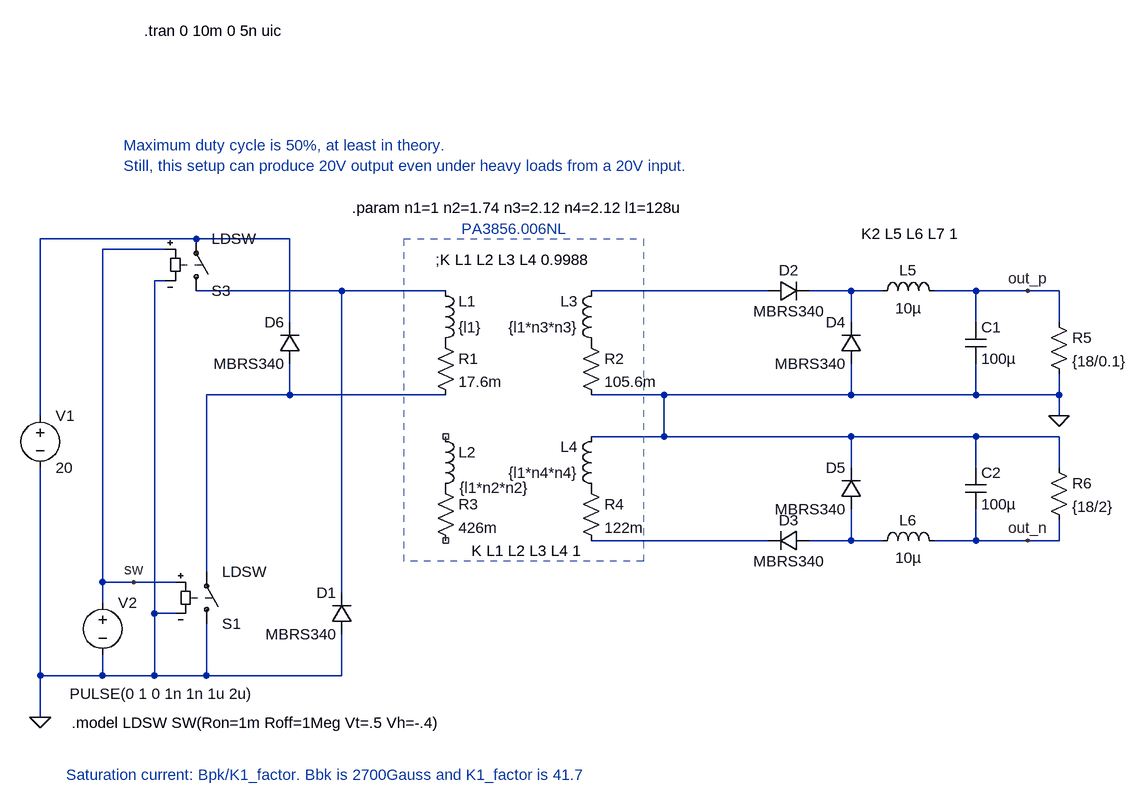
[diagram p0: schematic forward_regulator_test2.asc]
forward_regulator_test2.asc, the LTspice schematic file:
Version 4.1
SHEET 1 1368 2500
WIRE -240 16 -480 16
WIRE -96 16 -240 16
WIRE -288 32 -384 32
WIRE -288 80 -304 80
WIRE -16 96 -240 96
WIRE 144 96 -16 96
WIRE 640 96 368 96
WIRE 768 96 704 96
WIRE 816 96 768 96
WIRE 960 96 896 96
WIRE 1040 96 960 96
WIRE 1088 96 1040 96
WIRE -96 144 -96 16
WIRE 768 144 768 96
WIRE 960 144 960 96
WIRE 1088 144 1088 96
WIRE -96 256 -96 208
WIRE -96 256 -224 256
WIRE 144 256 -96 256
WIRE 480 256 368 256
WIRE 768 256 768 208
WIRE 768 256 480 256
WIRE 960 256 960 208
WIRE 960 256 768 256
WIRE 1088 256 1088 224
WIRE 1088 256 960 256
WIRE -480 288 -480 16
WIRE 1088 288 1088 256
WIRE 480 320 480 256
WIRE 480 320 368 320
WIRE 768 320 480 320
WIRE 960 320 768 320
WIRE 1088 320 960 320
WIRE 768 368 768 320
WIRE 960 368 960 320
WIRE 1088 368 1088 320
WIRE 640 480 368 480
WIRE 768 480 768 432
WIRE 768 480 704 480
WIRE 816 480 768 480
WIRE 960 480 960 432
WIRE 960 480 896 480
WIRE 1040 480 960 480
WIRE 1088 480 1088 448
WIRE 1088 480 1040 480
WIRE -224 528 -224 256
WIRE -384 544 -384 32
WIRE -336 544 -384 544
WIRE -272 544 -336 544
WIRE -16 560 -16 96
WIRE -384 576 -384 544
WIRE -304 592 -304 80
WIRE -272 592 -304 592
WIRE -480 688 -480 368
WIRE -384 688 -384 656
WIRE -384 688 -480 688
WIRE -304 688 -304 592
WIRE -304 688 -384 688
WIRE -224 688 -224 608
WIRE -224 688 -304 688
WIRE -16 688 -16 624
WIRE -16 688 -224 688
WIRE -480 752 -480 688
FLAG -480 752 0
FLAG 1088 288 0
FLAG 1040 96 out_p
FLAG 1040 480 out_n
FLAG -336 544 sw
SYMBOL ind 128 192 M180
WINDOW 0 36 80 Left 2
WINDOW 3 36 40 Left 2
SYMATTR InstName L1
SYMATTR Value {l1}
SYMATTR Type ind
SYMATTR SpiceLine Rser=1m
SYMBOL ind 128 304 R0
WINDOW 3 37 95 Left 2
SYMATTR Value {l1*n2*n2}
SYMATTR InstName L2
SYMATTR Type ind
SYMATTR SpiceLine Rser=1m
SYMBOL ind 384 192 R180
WINDOW 0 36 80 Left 2
WINDOW 3 36 40 Left 2
SYMATTR InstName L3
SYMATTR Value {l1*n3*n3}
SYMATTR Type ind
SYMATTR SpiceLine Rser=1m
SYMBOL ind 384 416 R180
WINDOW 0 36 80 Left 2
WINDOW 3 36 40 Left 2
SYMATTR InstName L4
SYMATTR Value {l1*n4*n4}
SYMATTR Type ind
SYMATTR SpiceLine Rser=1m
SYMBOL res 128 160 R0
SYMATTR InstName R1
SYMATTR Value 17.6m
SYMBOL res 352 160 R0
SYMATTR InstName R2
SYMATTR Value 105.6m
SYMBOL res 128 384 R0
SYMATTR InstName R3
SYMATTR Value 426m
SYMBOL res 352 384 R0
SYMATTR InstName R4
SYMATTR Value 122m
SYMBOL voltage -480 272 R0
SYMATTR InstName V1
SYMATTR Value 20
SYMBOL sw -224 624 M180
SYMATTR InstName S1
SYMATTR Value LDSW
SYMBOL diode 640 112 R270
WINDOW 0 32 32 VTop 2
WINDOW 3 0 32 VBottom 2
SYMATTR InstName D2
SYMATTR Value MBRS340
SYMBOL ind 800 112 R270
WINDOW 0 32 56 VTop 2
WINDOW 3 5 56 VBottom 2
SYMATTR InstName L5
SYMATTR Value 10µ
SYMATTR Type ind
SYMBOL cap 944 144 R0
SYMATTR InstName C1
SYMATTR Value 100µ
SYMBOL res 1072 128 R0
SYMATTR InstName R5
SYMATTR Value {18/0.1}
SYMBOL ind 912 496 M270
WINDOW 0 32 56 VTop 2
WINDOW 3 5 56 VBottom 2
SYMATTR InstName L6
SYMATTR Value 10µ
SYMATTR Type ind
SYMBOL cap 944 368 R0
SYMATTR InstName C2
SYMATTR Value 100µ
SYMBOL res 1072 352 R0
SYMATTR InstName R6
SYMATTR Value {18/2}
SYMBOL diode 704 464 R90
WINDOW 0 0 32 VBottom 2
WINDOW 3 32 32 VTop 2
SYMATTR InstName D3
SYMATTR Value MBRS340
SYMBOL diode 784 208 R180
WINDOW 0 24 64 Left 2
WINDOW 3 24 0 Left 2
SYMATTR InstName D4
SYMATTR Value MBRS340
SYMBOL diode 784 432 R180
WINDOW 0 24 64 Left 2
WINDOW 3 24 0 Left 2
SYMATTR InstName D5
SYMATTR Value MBRS340
SYMBOL diode 0 624 R180
WINDOW 0 24 64 Left 2
WINDOW 3 24 0 Left 2
SYMATTR InstName D1
SYMATTR Value MBRS340
SYMBOL voltage -384 560 R0
WINDOW 3 -51 156 Left 2
WINDOW 123 0 0 Left 0
WINDOW 39 0 0 Left 0
SYMATTR Value PULSE(0 1 0 1n 1n 1u 2u)
SYMATTR InstName V2
SYMBOL diode -80 208 R180
WINDOW 0 24 64 Left 2
WINDOW 3 24 0 Left 2
SYMATTR InstName D6
SYMATTR Value MBRS340
SYMBOL sw -240 112 M180
SYMATTR InstName S3
SYMATTR Value LDSW
TEXT 128 48 Left 2 !;K L1 L2 L3 L4 0.9988
TEXT 168 0 Left 2 ;PA3856.006NL
TEXT -432 760 Left 2 !.model LDSW SW(Ron=1m Roff=1Meg Vt=.5 Vh=-.4)
TEXT -320 -304 Left 2 !.tran 0 10m 0 5n uic
TEXT 184 496 Left 2 !K L1 L2 L3 L4 1
TEXT 0 -32 Left 2 !.param n1=1 n2=1.74 n3=2.12 n4=2.12 l1=128u
TEXT -352 -128 Left 2 ;Maximum duty cycle is 50%, at least in theory.\nStill, this setup can produce 20V output even under heavy loads from a 20V input.
TEXT -440 840 Left 2 ;Saturation current: Bpk/K1_factor. Bbk is 2700Gauss and K1_factor is 41.7
TEXT 784 8 Left 2 !K2 L5 L6 L7 1
RECTANGLE Normal 448 512 80 16 2

The netlist it stands for:
* forward_regulator_test2.asc
L1 P001 N002 {l1} Rser=1m
L2 NC_01 P002 {l1*n2*n2} Rser=1m
L3 P003 N003 {l1*n3*n3} Rser=1m
L4 P004 0 {l1*n4*n4} Rser=1m
R1 P001 N005 17.6m
R2 P003 0 105.6m
R3 P002 NC_02 426m
R4 P004 N006 122m
V1 N001 0 20
S1 0 N005 sw 0 LDSW
D2 N003 N004 MBRS340
L5 N004 out_p 10µ
C1 out_p 0 100µ
R5 out_p 0 {18/0.1}
L6 out_n N007 10µ
C2 0 out_n 100µ
R6 0 out_n {18/2}
D3 N007 N006 MBRS340
D4 0 N004 MBRS340
D5 N007 0 MBRS340
D1 0 N002 MBRS340
V2 sw 0 PULSE(0 1 0 1n 1n 1u 2u)
D6 N005 N001 MBRS340
S3 N002 N001 sw 0 LDSW
.model D D
.lib standard.dio
;K L1 L2 L3 L4 0.9988
* PA3856.006NL
.model LDSW SW(Ron=1m Roff=1Meg Vt=.5 Vh=-.4)
.tran 0 10m 0 5n uic
K L1 L2 L3 L4 1
.param n1=1 n2=1.74 n3=2.12 n4=2.12 l1=128u
* Maximum duty cycle is 50%, at least in theory.
* Still, this setup can produce 20V output even under heavy loads from a 20V input.
* Saturation current: Bpk/K1_factor. Bbk is 2700Gauss and K1_factor is 41.7
K2 L5 L6 L7 1
.backanno
.end